# Altium schematic sheet Documentation.SchDoc
size A; DocumentNumber: 15; SheetNumber: 15; SheetTotal: 16
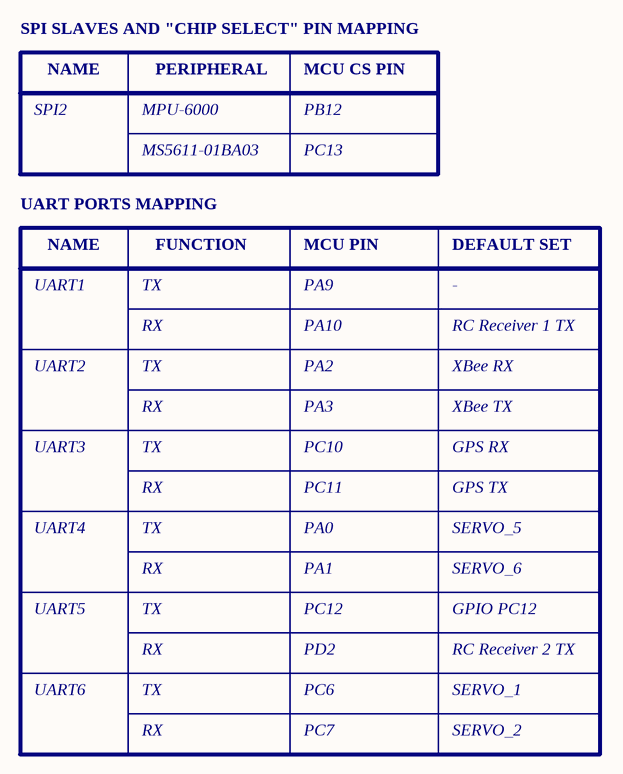
[diagram p0: Documentation.SchDoc]

## Notes on the sheet
- SPI SLAVES AND "CHIP SELECT" PIN MAPPING
- NAME
- PERIPHERAL
- MCU CS PIN
- SPI2
- MPU-6000
- MS5611-01BA03
- PB12
- PC13
- UART PORTS MAPPING
- UART1
- TX
- FUNCTION
- PA9
- MCU PIN
- -
- DEFAULT SET
- UART2
- RX
- PA10
- PA2
- RC Receiver 1 TX
- XBee RX
- PA3
- XBee TX
- UART3
- PC10
- PC11
- GPS RX
- GPS TX
- UART4
- PA0
- PA1
- SERVO_5
- SERVO_6
- UART5
- PC12
- GPIO PC12
- UART6
- PD2
- PC6
- RC Receiver 2 TX
- SERVO_1
- PC7
- SERVO_2
- Sheet Title:
- ProjectTitle:
- Size:
- Date:
- Company:
- A
- Number:
- Rev:
- Sheet         of
- Drawn by: